# EAGLE design Business_card_rev6 (EAGLE 7.3.0)

## Sheet 1 of 2
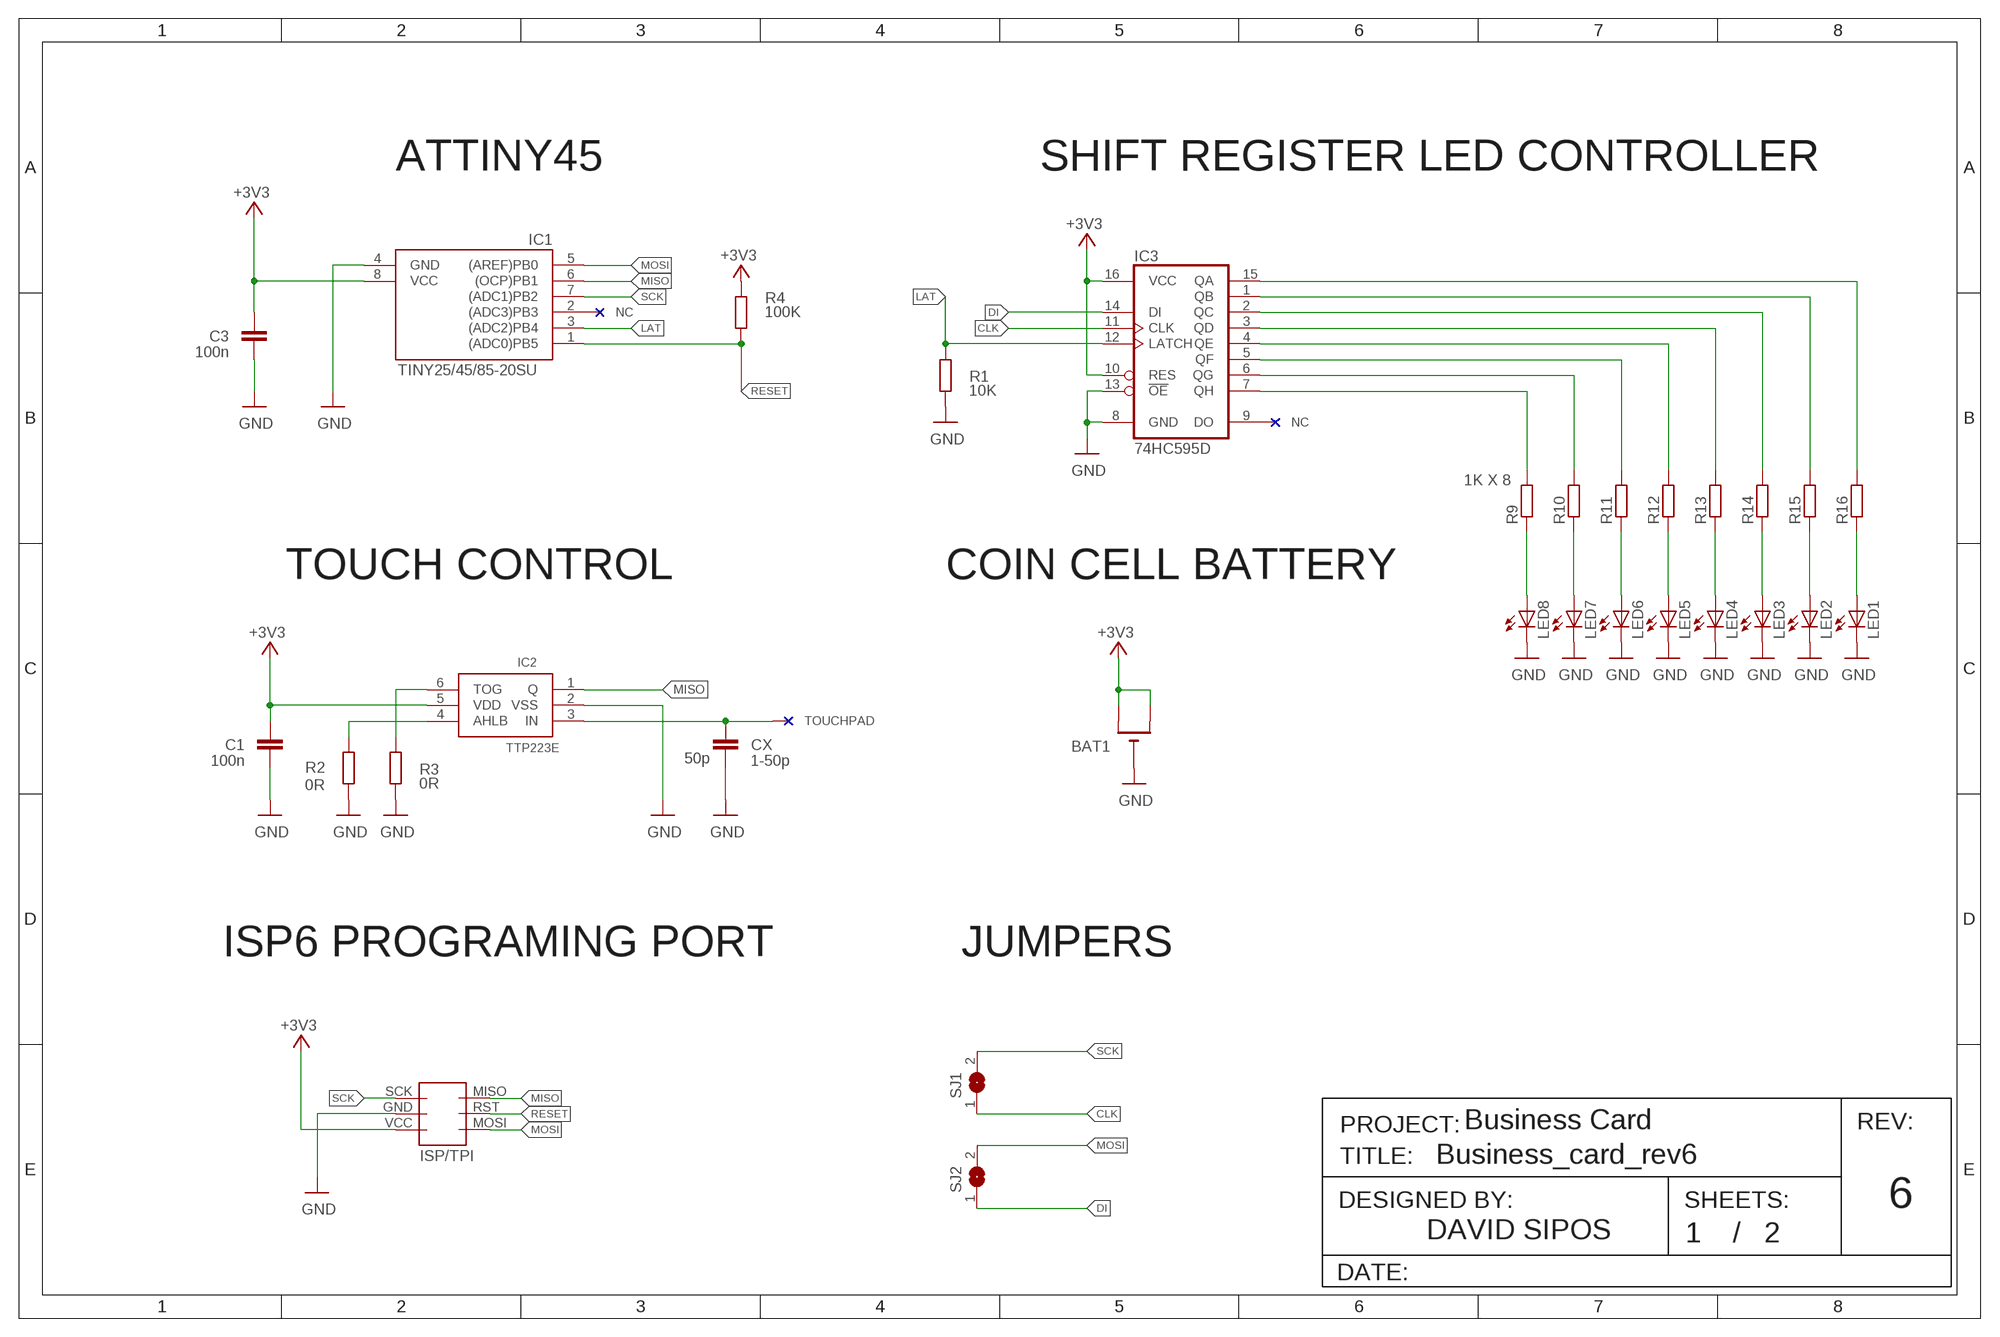
[diagram p0: schematic, sheet 1]

### Parts
BAT1  CR2032SMT  [CR2032-SMD]
C1  100n  C-EUC1206K  [C1206K]
C3  100n  C-EUC1206K  [C1206K]
CX  1-50p  C-EUC1206K  [C1206K]
IC1  TINY25/45/85-20SU  [SOIC8]
IC2  TTP223E  [SOT23-6]
IC3  74HC595D  [SO16]
LED1  LEDCHIPLED_0805  [CHIPLED_0805]
LED2  LEDCHIPLED_0805  [CHIPLED_0805]
LED3  LEDCHIPLED_0805  [CHIPLED_0805]
LED4  LEDCHIPLED_0805  [CHIPLED_0805]
LED5  LEDCHIPLED_0805  [CHIPLED_0805]
LED6  LEDCHIPLED_0805  [CHIPLED_0805]
LED7  LEDCHIPLED_0805  [CHIPLED_0805]
LED8  LEDCHIPLED_0805  [CHIPLED_0805]
R1  10K  R-EU_M0805  [M0805]
R2  0R  R-EU_M0805  [M0805]
R3  0R  R-EU_M0805  [M0805]
R4  100K  R-EU_M0805  [M0805]
R9  R-EU_M0805  [M0805]
R10  R-EU_M0805  [M0805]
R11  R-EU_M0805  [M0805]
R12  R-EU_M0805  [M0805]
R13  R-EU_M0805  [M0805]
R14  R-EU_M0805  [M0805]
R15  R-EU_M0805  [M0805]
R16  R-EU_M0805  [M0805]
SJ1  SJ  [SJ]
SJ2  SJ  [SJ]
U$11  AVR-ISP-6-EDGE  [6PAD_ISP]

### Nets
+3V3: BAT1.+$1(+) BAT1.+$2(+1) C1.2 C3.2 IC1.8(VCC) IC2.5(VDD) IC3.10(RES) IC3.16(VCC) R4.2 U$11.VCC ; also sheet 2
CAPSEN: CX.2 IC2.3(IN)
CLK: IC3.11(CLK) SJ1.1
DI: IC3.14(DI) SJ2.1
GND: BAT1.- C1.1 C3.1 CX.1 IC1.4(GND) IC2.2(VSS) IC3.8(GND) IC3.13(!OE) LED1.C LED2.C LED3.C LED4.C LED5.C LED6.C LED7.C LED8.C R1.2 R2.1 R3.1 U$11.GND ; also sheet 2
LAT: IC1.3((ADC2)PB4) IC3.12(LATCH) R1.1
MISO: IC1.6((OCP)PB1) IC2.1(Q) U$11.MISO
MOSI: IC1.5((AREF)PB0) SJ2.2 U$11.MOSI
N$1: IC3.15(QA) R16.2
N$3: IC3.1(QB) R15.2
N$4: IC2.6(TOG) R3.2
N$5: IC2.4(AHLB) R2.2
N$9: IC3.2(QC) R14.2
N$10: IC3.3(QD) R13.2
N$11: IC3.4(QE) R12.2
N$28: IC3.5(QF) R11.2
N$29: IC3.6(QG) R10.2
N$30: IC3.7(QH) R9.2
N$31: LED8.A R9.1
N$32: LED7.A R10.1
N$33: LED6.A R11.1
N$34: LED5.A R12.1
N$35: LED4.A R13.1
N$36: LED3.A R14.1
N$37: LED2.A R15.1
N$38: LED1.A R16.1
RESET: IC1.1((ADC0)PB5) R4.1 U$11.RST
SCK: IC1.7((ADC1)PB2) SJ1.2 U$11.SCK
Unconnected: IC1.2((ADC3)PB3) IC3.9(DO)

### Notes on the sheet
- ATTINY45 | SHIFT REGISTER LED CONTROLLER
- NC
- NC
- 1K X 8
- TOUCH CONTROL | COIN CELL BATTERY
- IC2
- TOUCHPAD
- TTP223E | 50p
- ISP6 PROGRAMING PORT | JUMPERS
- Business Card
- 6

## Sheet 2 of 2
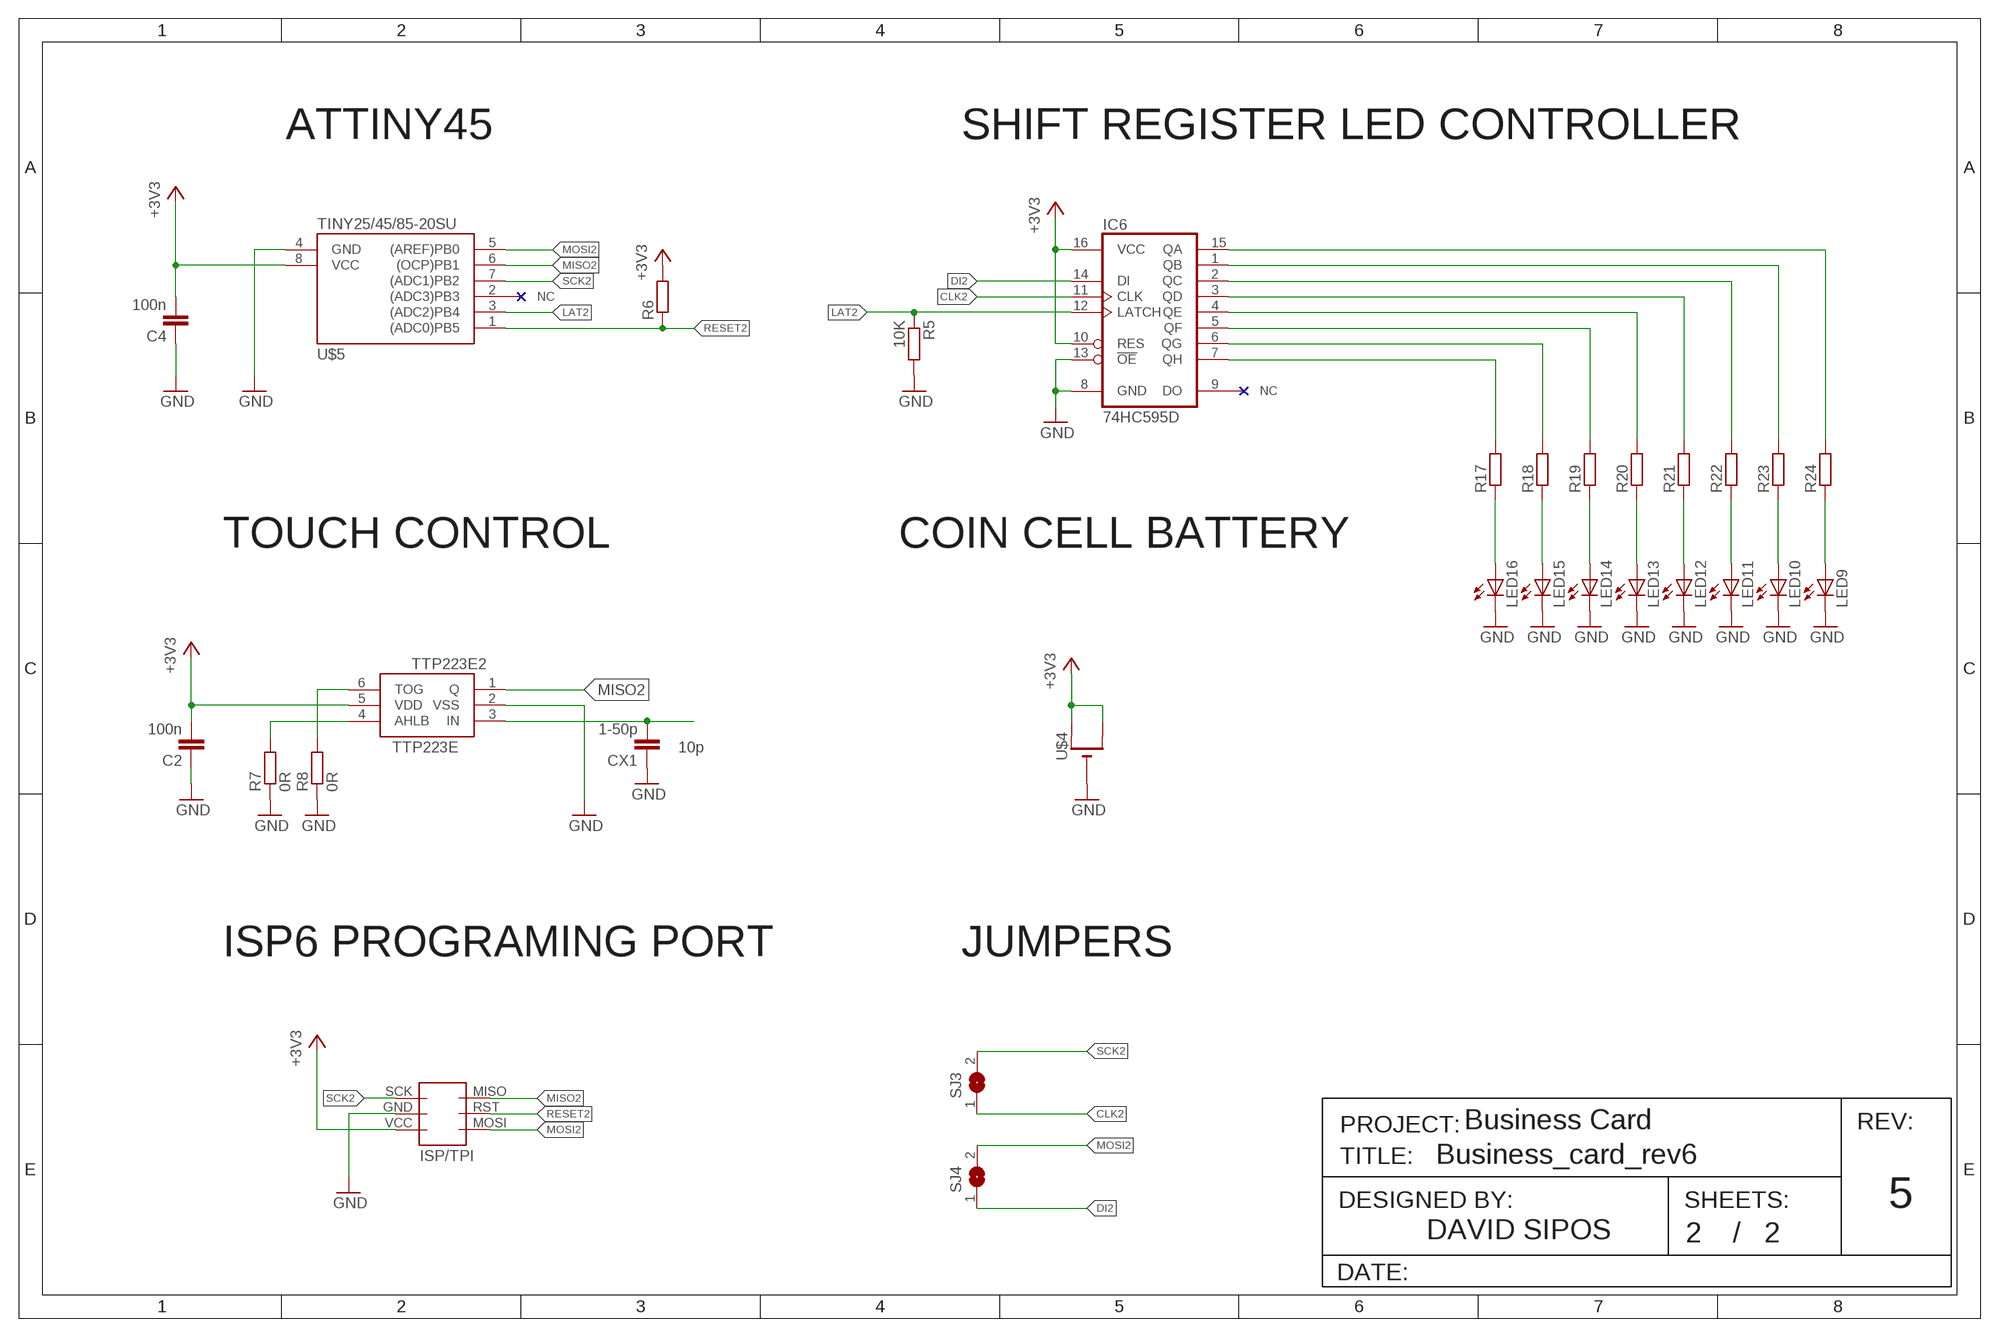
[diagram p1: schematic, sheet 2]

### Parts
C2  100n  C-EUC1206K  [C1206K]
C4  100n  C-EUC1206K  [C1206K]
CX1  1-50p  C-EUC1206K  [C1206K]
IC6  74HC595D  [SO16]
LED9  LEDCHIPLED_0805  [CHIPLED_0805]
LED10  LEDCHIPLED_0805  [CHIPLED_0805]
LED11  LEDCHIPLED_0805  [CHIPLED_0805]
LED12  LEDCHIPLED_0805  [CHIPLED_0805]
LED13  LEDCHIPLED_0805  [CHIPLED_0805]
LED14  LEDCHIPLED_0805  [CHIPLED_0805]
LED15  LEDCHIPLED_0805  [CHIPLED_0805]
LED16  LEDCHIPLED_0805  [CHIPLED_0805]
R5  10K  R-EU_M0805  [M0805]
R6  R-EU_M0805  [M0805]
R7  0R  R-EU_M0805  [M0805]
R8  0R  R-EU_M0805  [M0805]
R17  R-EU_M0805  [M0805]
R18  R-EU_M0805  [M0805]
R19  R-EU_M0805  [M0805]
R20  R-EU_M0805  [M0805]
R21  R-EU_M0805  [M0805]
R22  R-EU_M0805  [M0805]
R23  R-EU_M0805  [M0805]
R24  R-EU_M0805  [M0805]
SJ3  SJ  [SJ]
SJ4  SJ  [SJ]
TTP223E2  TTP223E  [SOT23-6]
U$4  CR2032SMT  [CR2032-SMD]
U$5  TINY25/45/85-20SU  [SOIC8]
U$12  AVR-ISP-6-EDGE  [6PAD_ISP]

### Nets
+3V3: C2.2 C4.2 IC6.10(RES) IC6.16(VCC) R6.2 TTP223E2.5(VDD) U$4.+$1(+) U$4.+$2(+1) U$5.8(VCC) U$12.VCC ; also sheet 1
CAPSEN1: CX1.2 TTP223E2.3(IN)
CLK2: IC6.11(CLK) SJ3.1
DI2: IC6.14(DI) SJ4.1
GND: C2.1 C4.1 CX1.1 IC6.8(GND) IC6.13(!OE) LED9.C LED10.C LED11.C LED12.C LED13.C LED14.C LED15.C LED16.C R5.2 R7.1 R8.1 TTP223E2.2(VSS) U$4.- U$5.4(GND) U$12.GND ; also sheet 1
LAT2: IC6.12(LATCH) R5.1 U$5.3((ADC2)PB4)
MISO2: TTP223E2.1(Q) U$5.6((OCP)PB1) U$12.MISO
MOSI2: SJ4.2 U$5.5((AREF)PB0) U$12.MOSI
N$2: R8.2 TTP223E2.6(TOG)
N$6: R7.2 TTP223E2.4(AHLB)
N$7: IC6.15(QA) R24.2
N$8: IC6.1(QB) R23.2
N$12: IC6.2(QC) R22.2
N$13: IC6.3(QD) R21.2
N$14: IC6.4(QE) R20.2
N$15: IC6.5(QF) R19.2
N$16: IC6.6(QG) R18.2
N$17: IC6.7(QH) R17.2
N$18: LED16.A R17.1
N$21: LED15.A R18.1
N$26: LED14.A R19.1
N$27: LED13.A R20.1
N$39: LED12.A R21.1
N$40: LED11.A R22.1
N$41: LED10.A R23.1
N$42: LED9.A R24.1
RESET2: R6.1 U$5.1((ADC0)PB5) U$12.RST
SCK2: SJ3.2 U$5.7((ADC1)PB2) U$12.SCK
Unconnected: IC6.9(DO) U$5.2((ADC3)PB3)

### Notes on the sheet
- ATTINY45 | SHIFT REGISTER LED CONTROLLER
- TOUCH CONTROL | COIN CELL BATTERY
- 10p
- ISP6 PROGRAMING PORT | JUMPERS
- Business Card
- 5

## Library data of the parts
BAT1 U$4 = adafruit:CR2032
C1-C4 CX CX1 = rcl:C-EU: CAPACITOR, European symbol
IC1 U$5 = avr-6:TINY25/45/85
IC2 TTP223E2 = MCU:TTP223E
IC3 IC6 = 74xx-eu:74*595: 8-bit SHIFT REGISTER, output latch
LED1-LED16 = led:LED: LED OSRAM: - CHIPLED LG R971, LG N971, LY N971, LG Q971, LY Q971, LO R971, LY R971 LH N974, LH R974 LS Q976, LO Q976, LY Q976 LO Q996 - Hyper CHIPLED LW Q18S LB Q993, LB Q99A, LB R99A - SideLED LS A670, LO A670, LY A670, LG A670, LP A670 LB A673, LV A673, LT A673, LW A673 LH A674 LY A675 LS A676, LA A676, LO A676, LY A676, LW A676 LS A679, LY A679, LG A679 - Hyper Micro SIDELED® LS Y876, LA Y876, LO Y876, LY Y876 LT Y87S - SmartLED LW L88C, LW L88S LB L89C, LB L89S, LG L890 LS L89K, LO L89K, LY L89K LS L896, LA L896, LO L896, LY L896 - TOPLED LS T670, LO T670, LY T670, LG T670, LP T670 LSG T670, LSP T670, LSY T670, LOP T670, LYG T670 LG T671, LOG T671, LSG T671 LB T673, LV T673, LT T673, LW T673 LH T674 LS T676, LA T676, LO T676, LY T676, LB T676, LH T676, LSB T676, LW T676 LB T67C, LV T67C, LT T67C, LS T67K, LO T67K, LY T67K, LW E67C LS E67B, LA E67B, LO E67B, LY E67B, LB E67C, LV E67C, LT E67C LW T67C LS T679, LY T679, LG T679 LS T770, LO T770, LY T770, LG T770, LP T770 LB T773, LV T773, LT T773, LW T773 LH T774 LS E675, LA E675, LY E675, LS T675 LS T776, LA T776, LO T776, LY T776, LB T776 LHGB T686 LT T68C, LB T68C - Hyper Mini TOPLED® LB M676 - Mini TOPLED Santana® LG M470 LS M47K, LO M47K, LY M47K Source: http://www.osram.convergy.de LUXEON: - LUMILED® LXK2-PW12-R00, LXK2-PW12-S00, LXK2-PW14-U00, LXK2-PW14-V00 LXK2-PM12-R00, LXK2-PM12-S00, LXK2-PM14-U00 LXK2-PE12-Q00, LXK2-PE12-R00, LXK2-PE12-S00, LXK2-PE14-T00, LXK2-PE14-U00 LXK2-PB12-K00, LXK2-PB12-L00, LXK2-PB12-M00, LXK2-PB14-N00, LXK2-PB14-P00, LXK2-PB14-Q00 LXK2-PR12-L00, LXK2-PR12-M00, LXK2-PR14-Q00, LXK2-PR14-R00 LXK2-PD12-Q00, LXK2-PD12-R00, LXK2-PD12-S00 LXK2-PH12-R00, LXK2-PH12-S00 LXK2-PL12-P00, LXK2-PL12-Q00, LXK2-PL12-R00 Source: www.luxeon.com KINGBRIGHT: KA-3528ASYC Source: www.kingbright.com
R1-R24 = rcl:R-EU_: RESISTOR, European symbol
SJ1-SJ4 = jumper:SJ: SMD solder JUMPER
U$11 U$12 = avr-6:AVR-ISP-6-EDGE: 6 pin edge connector for ISP with ATMEL MCUs. Developed by Craig Moates (craig at moates dot net). Library by David Blundell (blundar at gmail dot com). Often, even a 6 pin header is really inconvenient for board layout and/or production. This SMD-only header is our de-facto standard for using an edge connector for programming with the help of a 6pin/10pin to edge card adapter.

## Board
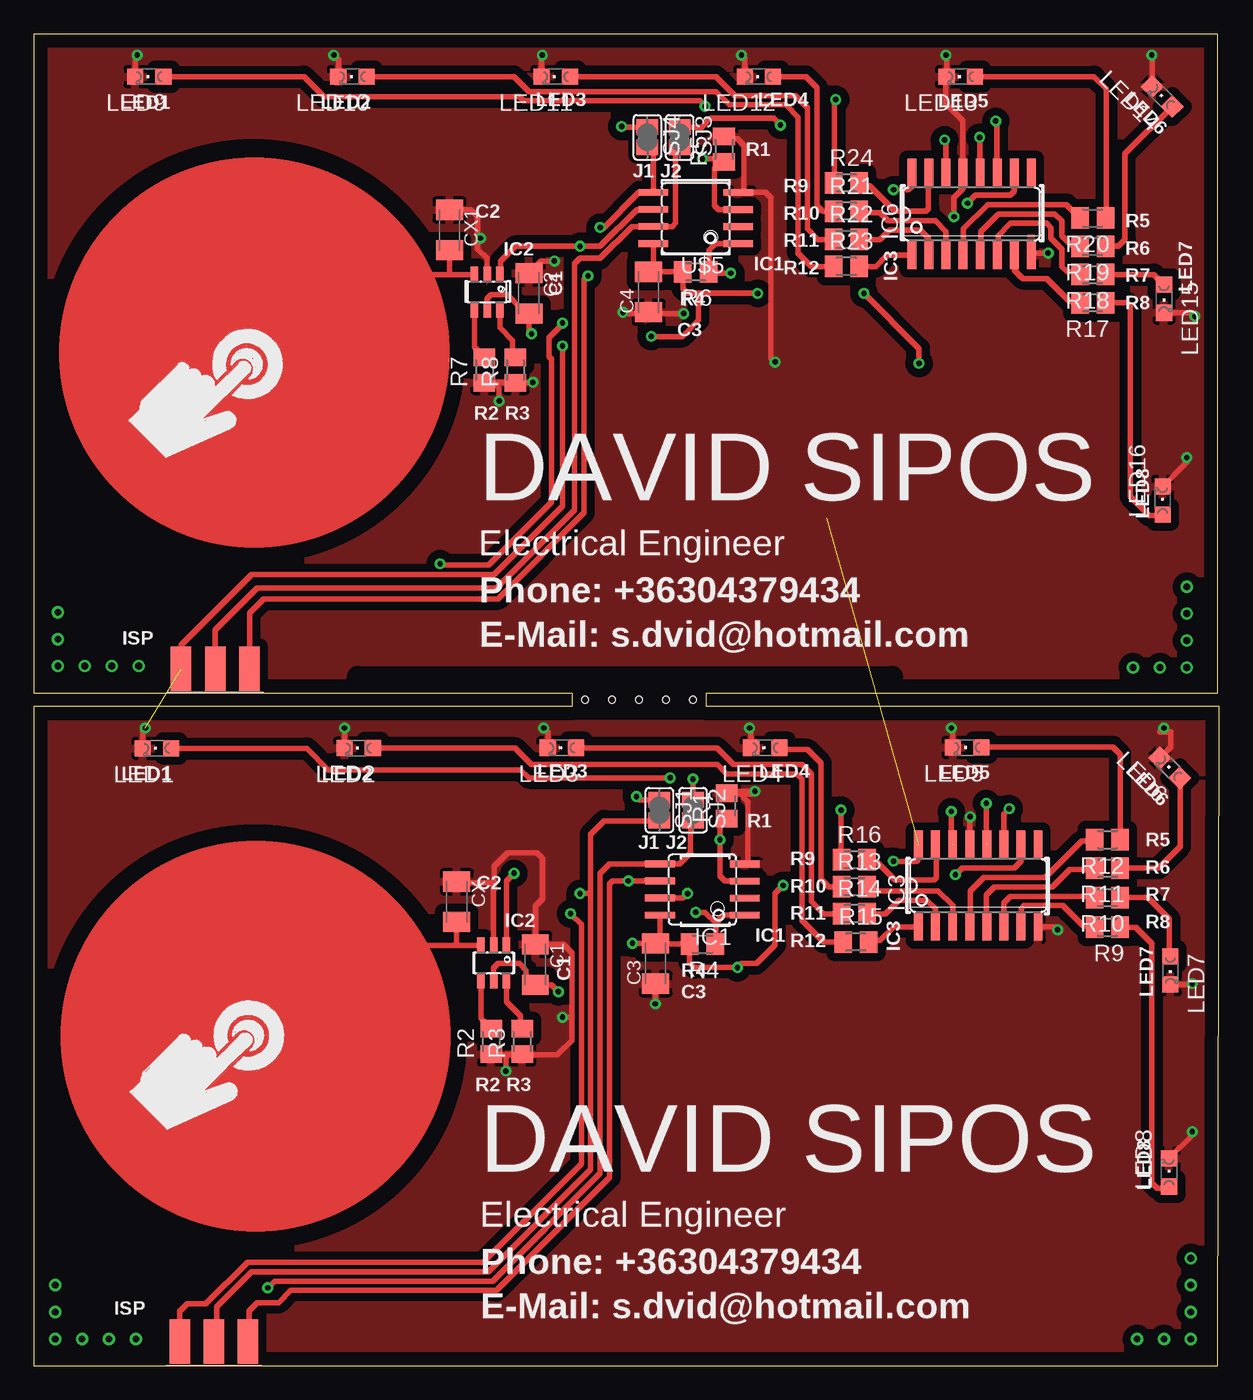
[diagram p2: board, top side]
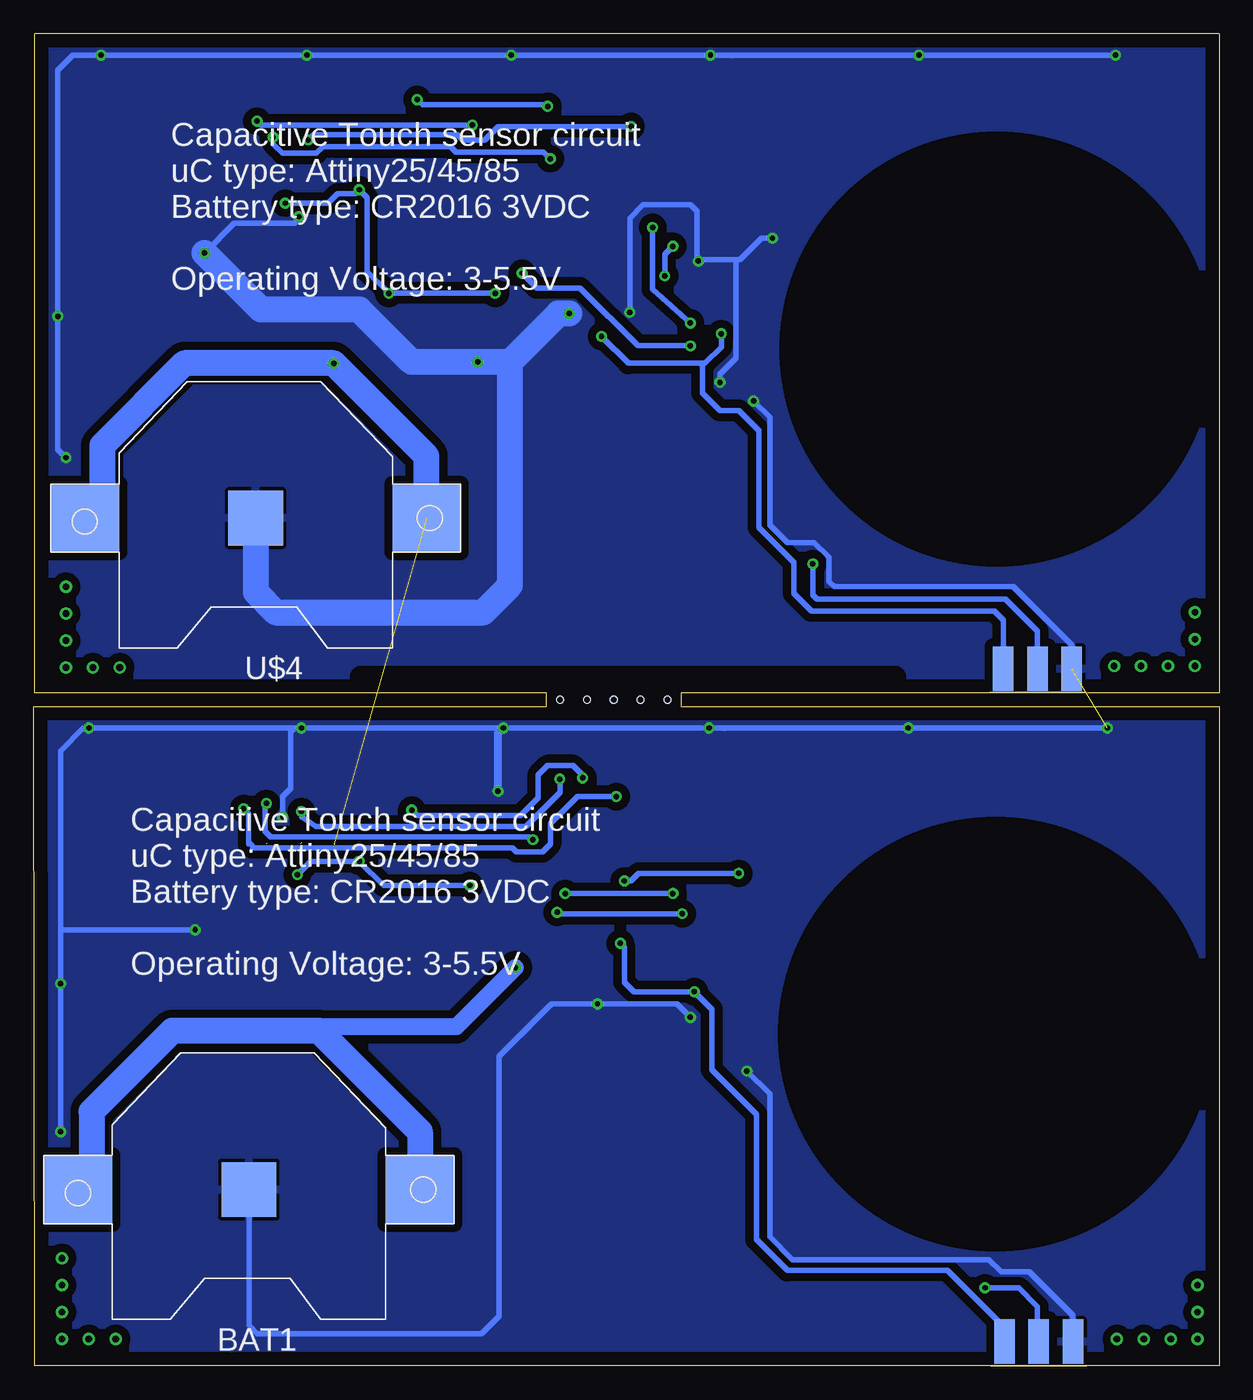
[diagram p3: board, bottom side, seen from below]

Size 88.1 x 99 mm. Coordinates in mm from the lower left corner, seen from the top.
Outline: 0,0 88,0 88.1,49 50,49 50,50 88,50 88,99 0,99 0,50 40,50 40,49 0,49 0,0
Copper layers (1*16): Top 0.035mm / dielectric 1.5mm / Bottom 0.035mm
Design rules "default": minimum track width 10mil, minimum drill 24mil, track to track 8mil, track to pad 8mil, pad to pad 8mil, via to via 8mil, smd to smd 8mil, copper to edge 40mil, drill to drill 8mil, minimum pad ring 10mil, minimum via ring 8mil, stop-mask expansion 4mil, vias tented up to drill 0mil, thermal gap 10mil
Holes 0.5 mm at 40.99,49.5 42.99,49.5 44.99,49.5 46.99,49.5 48.99,49.5
tRestrict: area 1.6,9.6 to 31.3,39.3; area 1.5,60.5 to 31.2,90.2; 4 lines
bRestrict: area 1.4,9.4 to 31.9,39.9; area 1.3,60.3 to 31.8,90.8; 4 lines

### Footprints (pad centres in the part's own frame; a part is rotated, then mirrored left to right if it is on the bottom)
CR2032-SMD = smd 5.08 x 5.08: +$1 -12.7,0; +$2 12.7,0 | smd 4.064 x 4.064: - 0,0
C1206K = smd 1.5 x 2: 1 -1.5,0; 2 1.5,0
SOIC8 = smd 0.5 x 2.2: 1 -1.905,-3.154; 2 -0.645,-3.154; 3 0.625,-3.154; 4 1.895,-3.154; 5 1.905,3.154; 6 0.635,3.154; 7 -0.635,3.154; 8 -1.905,3.154
SOT23-6 = smd 0.55 x 1.2: 1 -0.95,-1.3; 2 0,-1.3; 3 0.95,-1.3; 4 0.95,1.3; 5 0,1.3; 6 -0.95,1.3
SO16 = smd 0.66 x 2.032: 1 -4.445,-3.073; 2 -3.175,-3.073; 3 -1.905,-3.073; 4 -0.635,-3.073; 5 0.635,-3.073; 6 1.905,-3.073; 7 3.175,-3.073; 8 4.445,-3.073; 9 4.445,3.073; 10 3.175,3.073; 11 1.905,3.073; 12 0.635,3.073; 13 -0.635,3.073; 14 -1.905,3.073; 15 -3.175,3.073; 16 -4.445,3.073
CHIPLED_0805 = smd 1.2 x 1.2: A 0,-1.05; C 0,1.05
M0805 = smd 1.3 x 1.6: 1 -0.95,0; 2 0.95,0
SJ = smd 1.168 x 1.6: 1 -0.762,0; 2 0.762,0
6PAD_ISP = smd 1.524 x 3.302 bottom: GND 2.54,0; MOSI 0,0; VCC -2.54,0 | smd 1.524 x 3.302: MISO -2.54,0; RST 2.54,0; SCK 0,0

### Placement (x,y rotation side)
BAT1  72.1,13.1 180 bottom
C1  37.28,29.82 270 top
C2  36.8,79.7 270 top
C3  46.22,29.9 90 top
C4  45.7,79.8 90 top
CX  31.45,34.48 270 top
CX1  30.9,84.4 270 top
IC1  49.7,35.4 90 top
IC2  34.19,29.94 180 top
IC3  70.2,35.7 0 top
IC6  69.7,85.6 0 top
LED1  9.16,45.89 90 top
LED2  24.16,45.91 90 top
LED3  39.26,45.93 90 top
LED4  54.37,45.93 90 top
LED5  69.37,45.95 90 top
LED6  84.43,44.43 45 top
LED7  84.47,29.39 180 top
LED8  84.37,14.37 0 top
LED9  8.6,95.8 90 top
LED10  23.7,95.8 90 top
LED11  38.8,95.8 90 top
LED12  53.9,95.8 90 top
LED13  68.9,95.8 90 top
LED14  83.86,94.33 45 top
LED15  84,79.3 180 top
LED16  83.9,64.3 0 top
R1  51.49,41.62 90 top
R2  34,24.1 90 top
R3  36.3,24.1 90 top
R4  49.7,31.34 180 top
R5  51.3,90.4 90 top
R6  49.2,81.3 180 top
R7  33.5,74 90 top
R8  35.8,74 90 top
R9  79.8,32.6 180 top
R10  79.8,34.8 180 top
R11  79.8,37 180 top
R12  79.8,39.1 180 top
R13  61,35.6 0 top
R14  61,33.6 0 top
R15  61.1,31.5 0 top
R16  61,37.6 0 top
R17  78.7,79 180 top
R18  78.7,81.1 180 top
R19  78.7,83.2 180 top
R20  78.7,85.3 180 top
R21  60.4,85.8 0 top
R22  60.4,83.7 0 top
R23  60.4,81.7 0 top
R24  60.4,87.9 0 top
SJ1  46.5,41.3 270 top
SJ2  49,41.3 270 top
SJ3  48,91.3 270 top
SJ4  45.6,91.3 270 top
TTP223E2  33.7,79.8 180 top
U$4  71.6,63 180 bottom
U$5  49.2,85.3 90 top
U$11  13.4,1.8 180 top
U$12  13.5,51.8 180 top

### Tracks (layer width: path | path; a pad name or v marks a point on that pad's centre or on a via)
+3V3  (via drill 0.4, 0.4 pad 0.61)  (2 unrouted)
  Top 0.406: C3.2 46.28,31.34 R4.2 48.75,29.95 49.1,29.6 v52.3,29.6 52.6,29.9 53.7,29.9 55.1,31.3 55.1,35.1 v55.7,35.7 | IC2.5 34.19,29.59 34.5,29.9 36.1,29.9 36.6,29.4 36.6,29 C1.2 38.48,28.32 v39,27.8 | v68.5,36.5 69,37 72.9,37 73.38,37.48 IC3.10 | v63.9,37.5 65.6,37.5 65.7,37.6 65.7,38.72 | IC6.10 72.88,87.28 72.6,87 70,87 v69.4,86.4 | v63.9,87.4 65,87.4 65.3,87.7 65.3,88.63 IC6.16 | TTP223E2.5 33.7,79.3 34,79.6 35.2,79.6 36.2,78.6 36.4,78.6 C2.2 36.8,76.9 v37,76.7 | U$5.8 46.05,81.65 | 46.05,81.65 C4.2 | 46.05,81.65 46.39,81.3 R6.2 48.25,80.05 48.6,79.7 49.5,79.7 | 49.5,79.7 v53.8,79.7 | v65.8,74.5 65.8,75.6 v61.7,79.7 | IC1.8 46.55,31.73 C3.2 | v45.9,76.5 48.2,76.5 49.4,77.7 49.4,79.6 49.5,79.7 | v44.5,31.4 C3.2
  Bottom 0.406: v68.5,36.5 67.5,37.5 v63.9,37.5 62.1,35.7 v55.7,35.7 | v69.4,86.4 66.2,86.4 65.5,87.1 64.2,87.1 v63.9,87.4 63.3,86.8 63.3,81.3 v61.7,79.7 v53.8,79.7 | v37,76.7 37,75.7 38.2,74.5 38.6,74.5 | 38.6,74.5 43.9,74.5 v45.9,76.5 | U$12.VCC 16.04,55.44 16.7,56.1 30.3,56.1 31.6,57.4 31.6,59.7 34.2,62.3 34.2,69.5 35.7,71 37.1,71 38.4,72.3 38.4,74.3 38.6,74.5 | v44.5,31.4 44.2,31.1 44.2,28.5 43.5,27.8 v39,27.8 37.7,26.5 37.7,22 34.4,18.7 34.4,9.4 32.1,7.1 20.2,7.1 15.94,2.84 U$11.VCC
  Bottom 1.27: v52.3,29.6 56.7,25.2 67.1,25.2 67.4,24.9
  Bottom 1.93: U$4.+$1 58.9,67.6 v65.8,74.5 76.9,74.5 83,68.4 83,64.3 U$4.+$2 | BAT1.+$1 59.4,17.4 66.9,24.9 67.4,24.9 77.8,24.9 83.8,18.9 83.8,14.1 BAT1.+$2
CAPSEN
  Top 0.406: IC2.3 31.2,31.24 | 31.2,31.24 22.94,31.24 16.3,24.6 | CX.2 31.45,31.29 31.2,31.24
CAPSEN1
  Top 0.406: TTP223E2.3 30.9,81.1 | 30.9,81.1 22.2,81.1 15.3,74.2 | CX1.2 30.9,81.1
CLK  (via drill 0.4 pad 0.61)
  Top 0.406: v72.5,41.4 72.1,41 IC3.11 | SJ1.1 45.04,42.06 v44.8,42.3
  Bottom 0.406: v44.8,42.3 47.7,42.3 49.7,40.3 49.7,38.8 50.3,38.2 52.2,38.2 52.5,38.5 71.7,38.5 | 71.7,38.5 71.83,38.5 | v72.5,41.4 72.1,41.01 IC3.11 71.97,38.77 71.7,38.5
CLK2  (via drill 0.4)
  Top 0.406: SJ3.1 49.66,92.06 50.3,92.7 55,92.7 v55.5,92.2 | v71.5,92.5 71.6,92.4 IC6.11
  Bottom 0.406: v55.5,92.2 71.2,92.2 v71.5,92.5
DI  (via drill 0.4 pad 0.61)  (1 unrouted)
  Top 0.406: v68.2,41.2 68.2,38.87 | SJ2.1 v49,43.6
  Bottom 0.406: v49,43.6 49,42.6 51.5,40.1 67.1,40.1 68.2,40.8 v68.2,41.2
DI2  (via drill 0.4)
  Top 0.406: SJ4.1 43.74,92.06 v43.7,92.1 | v67.7,91.1 67.8,91 IC6.14
  Bottom 0.406: v43.7,92.1 53.6,92.1 54.6,91.1 56.2,91.1 56.6,91.5 67.3,91.5 v67.7,91.1
GND  (via drill 0.4, 0.4 pad 0.61)  (1 unrouted)
  Top 0.406: 34.2,73.05 R8.1 37.05,73.05 v37.1,73.1 | 34.2,73.05 R7.1 | LED1.C 8.11,47.21 v8.3,47.4 | v86.1,17.4 86.1,17.15 LED8.C | LED7.C 86.04,28.34 v86.1,28.4 | LED6.C 84.5,46 84.5,47.09 83.69,47.09 v84,47.4 | LED5.C 68.32,47.28 v68.2,47.4 | LED4.C 53.32,47.28 v53.2,47.4 | LED3.C 38.21,47.09 v37.9,47.4 | LED2.C v23.11,47.39 v23.1,47.4 | 53.09,37.3 53.1,37.3 53.1,41.9 52.4,42.6 51.52,42.6 R1.2 | v76.1,32.4 75.87,32.63 IC3.8 | LED9.C 7.55,97.25 v7.7,97.4 | v85.7,67.5 85.7,67.15 LED16.C | LED15.C 86.05,78.25 v86.3,78 | LED14.C 83.12,97.38 v83.1,97.4 | v67.8,97.4 67.85,97.35 LED13.C 67.8,95.75 67.8,93.8 69.06,92.53 IC6.13 69.06,87.47 68.4,86.8 v68.4,85.4 | LED12.C 52.85,97.15 v52.6,97.4 | LED11.C 37.75,97.35 v37.8,97.4 | LED10.C 22.65,97.05 v22.3,97.4 | 33,83.8 33,85.4 32.5,85.9 CX1.1 | TTP223E2.2 33.7,82.3 33,83 33,83.8 | 33,83.8 v33.2,83.8 | v38.7,82.1 37.7,82.1 C2.1 | U$5.4 52.8,87.19 52.8,87.2 52.8,87.3 | R5.2 51.25,91.2 52.3,91.2 52.8,90.7 52.8,87.3 | v75.4,82.7 74.32,82.7 IC6.8 | v48.3,78.2 45.6,78.2 | 45.6,78.2 C4.1 | 52.8,87.3 52.9,87.2 54.4,87.2 54.8,86.8 54.8,74.9 v55.1,74.6 | IC3.13 69.56,40.77 v69.6,40.8 | v34.6,71.7 34.6,72.65 34.2,73.05 | 45.6,78.2 43.9,78.2 v43.8,78.3 | v35.1,21.9 35.1,23.1 | 35.1,23.1 34.05,23.1 R2.1 | 35.1,23.1 35.15,23.15 R3.1 36.35,23.1 38.9,23.1 40,24.2 40,26 | IC2.2 34.19,35.4 | 34.19,35.4 34.19,35.71 34,35.9 31.53,35.9 CX.1 | 34.19,35.4 34.2,35.41 34.2,37.1 35.2,38.1 37.4,38.1 37.8,37.7 37.8,34.7 37.28,34.18 C1.1 39.38,31.32 40,30.7 40,26 | C3.1 46.22,26.92 v46.2,26.9 | v39.3,25.9 39.9,25.9 40,26
  Top 0.61: 52.4,42.6 53.5,42.6 v53.6,42.7
  Bottom 0.406: v8.3,47.4 v23.1,47.4 36.3,47.4 | 36.3,47.4 v37.9,47.4 v53.2,47.4 v68.2,47.4 68.7,47.4 | 68.7,47.4 v84,47.4 84.4,47.4 86.1,45.7 86.1,32.3 | 86.1,32.3 v86.1,28.4 v86.1,17.4 | v76.1,32.4 86,32.4 86.1,32.3 | v69.6,40.8 69.6,42.3 69,42.9 69,47.1 68.7,47.4 | 36.75,47.35 36.3,47.4 | v7.7,97.4 v22.3,97.4 36.2,97.4 | 36.2,97.4 v37.8,97.4 v52.6,97.4 v67.8,97.4 v83.1,97.4 85.2,97.4 86.3,96.3 v86.3,78 86.3,68.1 v85.7,67.5 | v33.2,83.8 34,83.8 35.6,82.2 35.9,82.2 | 35.9,82.2 38.6,82.2 v38.7,82.1 38.8,82.2 38.8,85.8 39.3,86.3 42.8,86.3 43.8,85.3 v43.8,78.3 | 36.23,97.37 36.2,97.4 | v68.4,85.4 68.4,85.2 68.7,84.9 73.2,84.9 v75.4,82.7 | U$12.GND 10.96,53.56 15.3,57.9 28.6,57.9 29,58.3 29,60.1 30.1,61.2 32.1,61.2 33.4,62.5 33.4,70.5 v34.6,71.7 | v37.1,73.1 37.1,73.7 35.9,74.9 35.9,82.2 | U$11.GND 10.86,3.76 14.1,7 16.2,7 17.1,7.9 31.7,7.9 33.4,9.6 33.4,20.2 v35.1,21.9 | v39.3,25.9 40.3,26.9 v46.2,26.9 49.6,26.9 53.5,23 53.5,3.7 54.8,2.4 71.5,2.4 72.1,3 BAT1.-
  Bottom 0.61: v53.6,42.7 53.6,47 v53.2,47.4
  Bottom 1.93: U$4.- 71.6,57.5 70.1,56 54.7,56 52.7,58 52.7,74.6 | v48.3,78.2 49.1,78.2 52.7,74.6 | 52.7,74.6 v55.1,74.6 60,74.6 63.9,78.5 71.2,78.5 v75.4,82.7
  pour Bottom (isolate 0.61): -1.43,101.3 90.04,100.49 90.04,-2.12 -1.61,-1.24
  pour Top (isolate 0.61): -1.53,101.39 90.08,101.37 90.18,-1.13 -1.74,-0.93
LAT  (via drill 0.4 pad 0.61)  (1 unrouted)
  Top 0.406: 51,40.18 R1.1 51.37,40.67 | 51.37,40.67 51,40.3 | 51,40.3 51,40.18 | v70.8,41.8 70.8,38.81 | IC1.3 51.38,36.02 51,36.4 v51,39.1 51,40.18 | 51.37,40.67 51.33,40.67 51,41 51,40.3
  Bottom 0.406: v51,39.1 51.1,39.1 51.3,39.3 70.5,39.3 70.9,39.7 70.9,41.7 v70.8,41.8
LAT2  (via drill 0.4)
  Top 0.406: U$5.3 52.33,85.9 50.9,85.9 50.6,86.2 50.6,89 51.05,89.45 R5.1 51.05,89.7 v49.7,89.7 | IC6.12 70.33,91.27 v70.3,91.3
  Bottom 0.406: v70.3,91.3 70.3,90.8 69.6,90.1 67.1,90.1 66.6,90.6 57.1,90.6 56.7,90.2 50.2,90.2 v49.7,89.7
MISO  (via drill 0.4)
  Top 0.406: IC1.6 v44.2,36.03 43.04,36.03 42.8,35.8 42.8,14 34.4,5.6 19.1,5.6 18.2,4.7 16.6,4.7 16,4.1 16,1.86 U$11.MISO | IC2.1 35.14,36.04 v35.7,36.6
  Bottom 0.406: v35.7,36.6 43.14,36.6 43.7,36.03 v44.2,36.03
MISO2  (via drill 0.4)
  Top 0.406: U$5.6 44.84,85.94 42.1,83.2 v40.6,83.2 35.8,83.2 34.7,82.1 34.7,81.15 TTP223E2.1 | U$12.MISO 16.04,55.94 17.1,57 34.5,57 40.9,63.4 40.9,80.7 v41.2,81
  Bottom 0.406: v41.2,81 41.2,82.6 v40.6,83.2
MOSI  (via drill 0.4)
  Top 0.406: v17.4,5.8 17.9,6.3 34.1,6.3 42.1,14.3 42.1,36.6 42.8,37.3 IC1.5 48.01,37.3 48.8,38.1 48.8,40.34 SJ2.2
  Bottom 0.406: v17.4,5.8 14.9,5.8 13.5,4.4 13.5,1.9 U$11.MOSI
MOSI2  (via drill 0.4)
  Top 0.406: SJ4.2 46.05,90.09 U$5.5 45.01,87.2 42.3,84.5 v42.1,84.6 | v39.3,77.5 39.3,77.4 38.3,76.4 38.3,75 38.5,74.8 38.5,64.2 33.8,59.5 30.3,59.5 v30.2,59.6
  Bottom 0.406: v42.1,84.6 42.1,80 v39.3,77.5 | v30.2,59.6 30.2,57.3 29.9,57 15.9,57 13.5,54.6 U$12.MOSI
N$1
  Top 0.406: IC3.15 67.1,38.7 67.1,36.3 66.9,36.1 64,36.1 62.7,37.4 62.15,37.4 R16.2
N$2
  Top 0.406: TTP223E2.6 34.65,77.15 35.6,76.2 35.6,75.15 R8.2
N$3
  Top 0.406: IC3.1 63.93,32.63 62.9,31.6 62.15,31.6 R15.2
N$4
  Top 0.406: IC2.6 35.14,27.06 36.2,26 36.2,25.15 R3.2
N$5
  Top 0.406: IC2.4 33.24,25.81 R2.2
N$6
  Top 0.406: TTP223E2.4 32.75,75.7 R7.2
N$7
  Top 0.406: IC6.15 66.5,88.65 66.5,86 66.3,85.8 64,85.8 62.1,87.7 61.55,87.7 R24.2
N$8
  Top 0.406: IC6.1 63.43,82.53 62.6,81.7 R23.2
N$9
  Top 0.406: IC3.2 67,32.65 67,34 66.4,34.6 64.3,34.6 63.3,33.6 R14.2
N$10
  Top 0.406: IC3.3 68.3,34.2 67.2,35.3 62.25,35.3 R13.2
N$11
  Top 0.406: IC3.4 69.6,32.66 69.6,35.3 70.6,36.3 75.2,36.3 77.9,39 78.75,39 R12.2
N$12
  Top 0.406: IC6.2 66.5,82.55 66.5,83.8 65.9,84.4 63.6,84.4 62.9,83.7 R22.2
N$13
  Top 0.406: IC6.3 67.8,84.3 67,85.1 63.5,85.1 62.9,85.7 61.45,85.7 R21.2
N$14
  Top 0.406: IC6.4 69.1,82.56 69.1,84.5 70.9,86.3 76.75,86.3 R20.2
N$15
  Top 0.406: IC6.5 70.4,82.59 70.4,84.3 71.7,85.6 75.9,85.6 76.4,85.1 76.4,84 77.1,83.3 77.65,83.3 R19.2
N$16
  Top 0.406: IC6.6 71.7,82.62 71.7,84 72.6,84.9 75.3,84.9 75.6,84.6 75.6,83.8 76.4,83 76.4,81.7 76.8,81.3 77.55,81.3 R18.2
N$17
  Top 0.406: IC6.7 72.88,81.42 73.5,80.8 75.3,80.8 77,79.1 77.65,79.1 R17.2
N$18
  Top 0.406: R17.1 81.3,79 81.5,78.8 81.5,64.6 82.9,63.2 83.85,63.2 LED16.A
N$19  (via drill 0.5 pad 0.41)
  other vias: 86,8
N$20  (via drill 0.5 pad 0.41)
  other vias: 86,6
N$21
  Top 0.406: R18.1 83.25,81.1 LED15.A
N$22  (via drill 0.5 pad 0.41)
  other vias: 86,4
N$23  (via drill 0.5 pad 0.41)
  other vias: 86,2
N$24  (via drill 0.5 pad 0.41)
  other vias: 84,2
N$25  (via drill 0.5 pad 0.41)
  other vias: 82,2
N$26
  Top 0.406: R19.1 80.6,83.2 81.1,83.7 81.1,90.08 LED14.A
N$27
  Top 0.406: LED13.A 78.8,95.8 79.7,94.9 79.7,85.35 R20.1
N$28
  Top 0.406: IC3.5 70.8,32.66 70.8,35 71.4,35.6 75.7,35.6 77,36.9 78.75,36.9 R11.2
N$29
  Top 0.406: IC3.6 72.1,34.4 72.6,34.9 78.75,34.9 R10.2
N$30
  Top 0.406: IC3.7 73.4,32.65 73.4,34 73.6,34.2 76.5,34.2 78,32.7 78.75,32.7 R9.2
N$31
  Top 0.406: R9.1 81.9,32.6 83.1,31.4 83.1,13.6 83.5,13.2 84.25,13.2 LED8.A
N$32
  Top 0.406: R10.1 82.8,34.8 84.4,33.2 84.4,30.51 LED7.A
N$33
  Top 0.406: R11.1 83.6,37 85.2,38.6 85.2,43.66 LED6.A
N$34
  Top 0.406: R12.1 80.75,45.45 80.2,46 70.47,46 LED5.A
N$35
  Top 0.406: R13.1 59.1,35.6 58.5,36.2 58.5,44.8 57.5,45.8 55.55,45.8 LED4.A
N$36
  Top 0.406: R14.1 58.7,33.6 57.8,34.5 57.8,44 57.1,44.7 52,44.7 50.77,45.93 LED3.A
N$37
  Top 0.406: R15.1 58.7,31.5 57.1,33.1 57.1,43.6 56.7,44 51.5,44 50.8,44.7 37,44.7 35.79,45.91 LED2.A
N$38  (via drill 0.4)
  Top 0.406: LED1.A 20.31,45.89 21.9,44.3 36.2,44.3 36.8,43.7 v47.3,43.7 | v60,41.3 60,37.65 R16.1
  Bottom 0.406: v47.3,43.7 47.3,43.9 48,44.6 49.9,44.6 50.6,43.9 50.6,42.2 51.9,40.9 59.6,40.9 v60,41.3
N$39
  Top 0.406: R21.1 58.6,85.8 58.2,86.2 58.2,95 57.4,95.8 LED12.A
N$40
  Top 0.406: R22.1 58.3,83.7 57.5,84.5 57.5,93.5 56.6,94.4 52.1,94.4 50.7,95.8 LED11.A
N$41
  Top 0.406: R23.1 57.8,81.7 56.8,82.7 56.8,92.8 55.9,93.7 51.7,93.7 50.7,94.7 36.8,94.7 35.7,95.8 LED10.A
N$42  (via drill 0.4)
  Top 0.406: LED9.A 20.1,95.8 21.6,94.3 36.1,94.3 36.4,94 49.5,94 v49.9,93.6 | v59.6,94.1 59.5,94.1 59.5,87.95 R24.1
  Bottom 0.406: v49.9,93.6 50,93.7 59.2,93.7 v59.6,94.1
N$43  (via drill 0.5 pad 0.41)
  other vias: 85.7,57.9
N$44  (via drill 0.5 pad 0.41)
  other vias: 85.7,55.9
N$45  (via drill 0.5 pad 0.41)
  other vias: 85.7,53.9
N$46  (via drill 0.5 pad 0.41)
  other vias: 85.7,51.9
N$47  (via drill 0.5 pad 0.41)
  other vias: 83.7,51.9
N$48  (via drill 0.5 pad 0.41)
  other vias: 81.7,51.9
N$49  (via drill 0.5 pad 0.41)
  other vias: 7.8,52
N$50  (via drill 0.5 pad 0.41)
  other vias: 5.8,52
N$51  (via drill 0.5 pad 0.41)
  other vias: 3.8,52
N$52  (via drill 0.5 pad 0.41)
  other vias: 1.8,52
N$53  (via drill 0.5 pad 0.41)
  other vias: 1.8,54
N$54  (via drill 0.5 pad 0.41)
  other vias: 1.8,56
N$55  (via drill 0.5 pad 0.41)
  other vias: 7.6,2
N$56  (via drill 0.5 pad 0.41)
  other vias: 5.6,2
N$57  (via drill 0.5 pad 0.41)
  other vias: 3.6,2
N$58  (via drill 0.5 pad 0.41)
  other vias: 1.6,2
N$59  (via drill 0.5 pad 0.41)
  other vias: 1.6,4
N$60  (via drill 0.5 pad 0.41)
  other vias: 1.6,6
RESET  (via drill 0.4)
  Top 0.406: IC1.1 51.3,33.49 50.7,32.9 | 50.7,32.9 50.7,31.39 R4.1 | U$11.RST 10.86,4.06 11.4,4.6 12.8,4.6 15.9,7.7 33.4,7.7 40.7,15 40.7,32.8 v39.9,33.6 | v49.2,33.7 49.9,33.7 50.7,32.9
  Bottom 0.406: v39.9,33.6 49.1,33.6 v49.2,33.7
RESET2  (via drill 0.4)
  Top 0.406: U$12.RST 10.96,53.56 16.2,58.8 34.2,58.8 39.3,63.9 v39.3,75.8 | v51.8,81.2 50.25,81.2 R6.1 50.2,81.35 50.2,82.9 50.7,83.39 U$5.1
  Bottom 0.406: v39.3,75.8 43.2,75.8 47.5,80.1 50.7,80.1 v51.8,81.2
SCK  (via drill 0.4)
  Top 0.406: 41.4,35.2 41.4,39.5 42.4,40.5 46.46,40.5 SJ1.2 | 41.4,35.2 41.4,14.6 33.8,7 16.2,7 13.6,4.4 13.6,2 U$11.SCK | IC1.7 48.27,34.77 v48.6,35.1 | v40.6,35.1 41.3,35.1 41.4,35.2
  Bottom 0.406: v48.6,35.1 v40.6,35.1
SCK2
  Top 0.406: SJ3.2 47.7,90.24 47.7,84.9 47.47,84.67 U$5.7 44.47,84.67 42.1,82.3 40.6,82.3 40.2,81.9 40.2,63.6 34.4,57.8 16.6,57.8 13.5,54.7 U$12.SCK
(copper drawn outside any net)
  shapes: Top circle x2

### Text on the board
_tsilk: LED3 | LED4 | LED5 | LED6 | LED1 | LED2 | R1 | J1 J2 | C2 | IC2 | IC1 | R9 / R10 / R11 / R12 | IC3 | C1 | LED7 | R4 | R5 / R6 / R7 / R8 | C3 | R2 R3 | DAVID SIPOS | LED8 | Electrical Engineer | Phone: +36304379434 | ISP | E-Mail: s.dvid@hotmail.com | LED1 | LED2 | LED3 | LED4 | LED5 | LED6 | R1 | J1 J2 | C2 | IC2 | IC1 | R5 / R6 / R7 / R8 | R9 / R10 / R11 / R12 | IC3 | C1 | R4 | C3 | LED7 | R2 R3 | DAVID SIPOS | LED8 | Electrical Engineer | Phone: +36304379434 | ISP | E-Mail: s.dvid@hotmail.com
_bsilk: Capacitive Touch sensor circuit / uC type: Attiny25/45/85 / Battery type: CR2016 3VDC / / Operating Voltage: 3-5.5V | Capacitive Touch sensor circuit / uC type: Attiny25/45/85 / Battery type: CR2016 3VDC / / Operating Voltage: 3-5.5V
201bmp: C:/Users/sdvid/OneDrive/Asztali gép/qrcode.bmp | C:/Users/sdvid/OneDrive/Asztali gép/qrcode.bmp